# Altium schematic sheet [03] - FMCP_1&2.SchDoc
size A3; Author: Orcel Thys; DrawnBy: Orcel Thys; DocumentNumber: 10; SheetNumber: 10; SheetTotal: 14
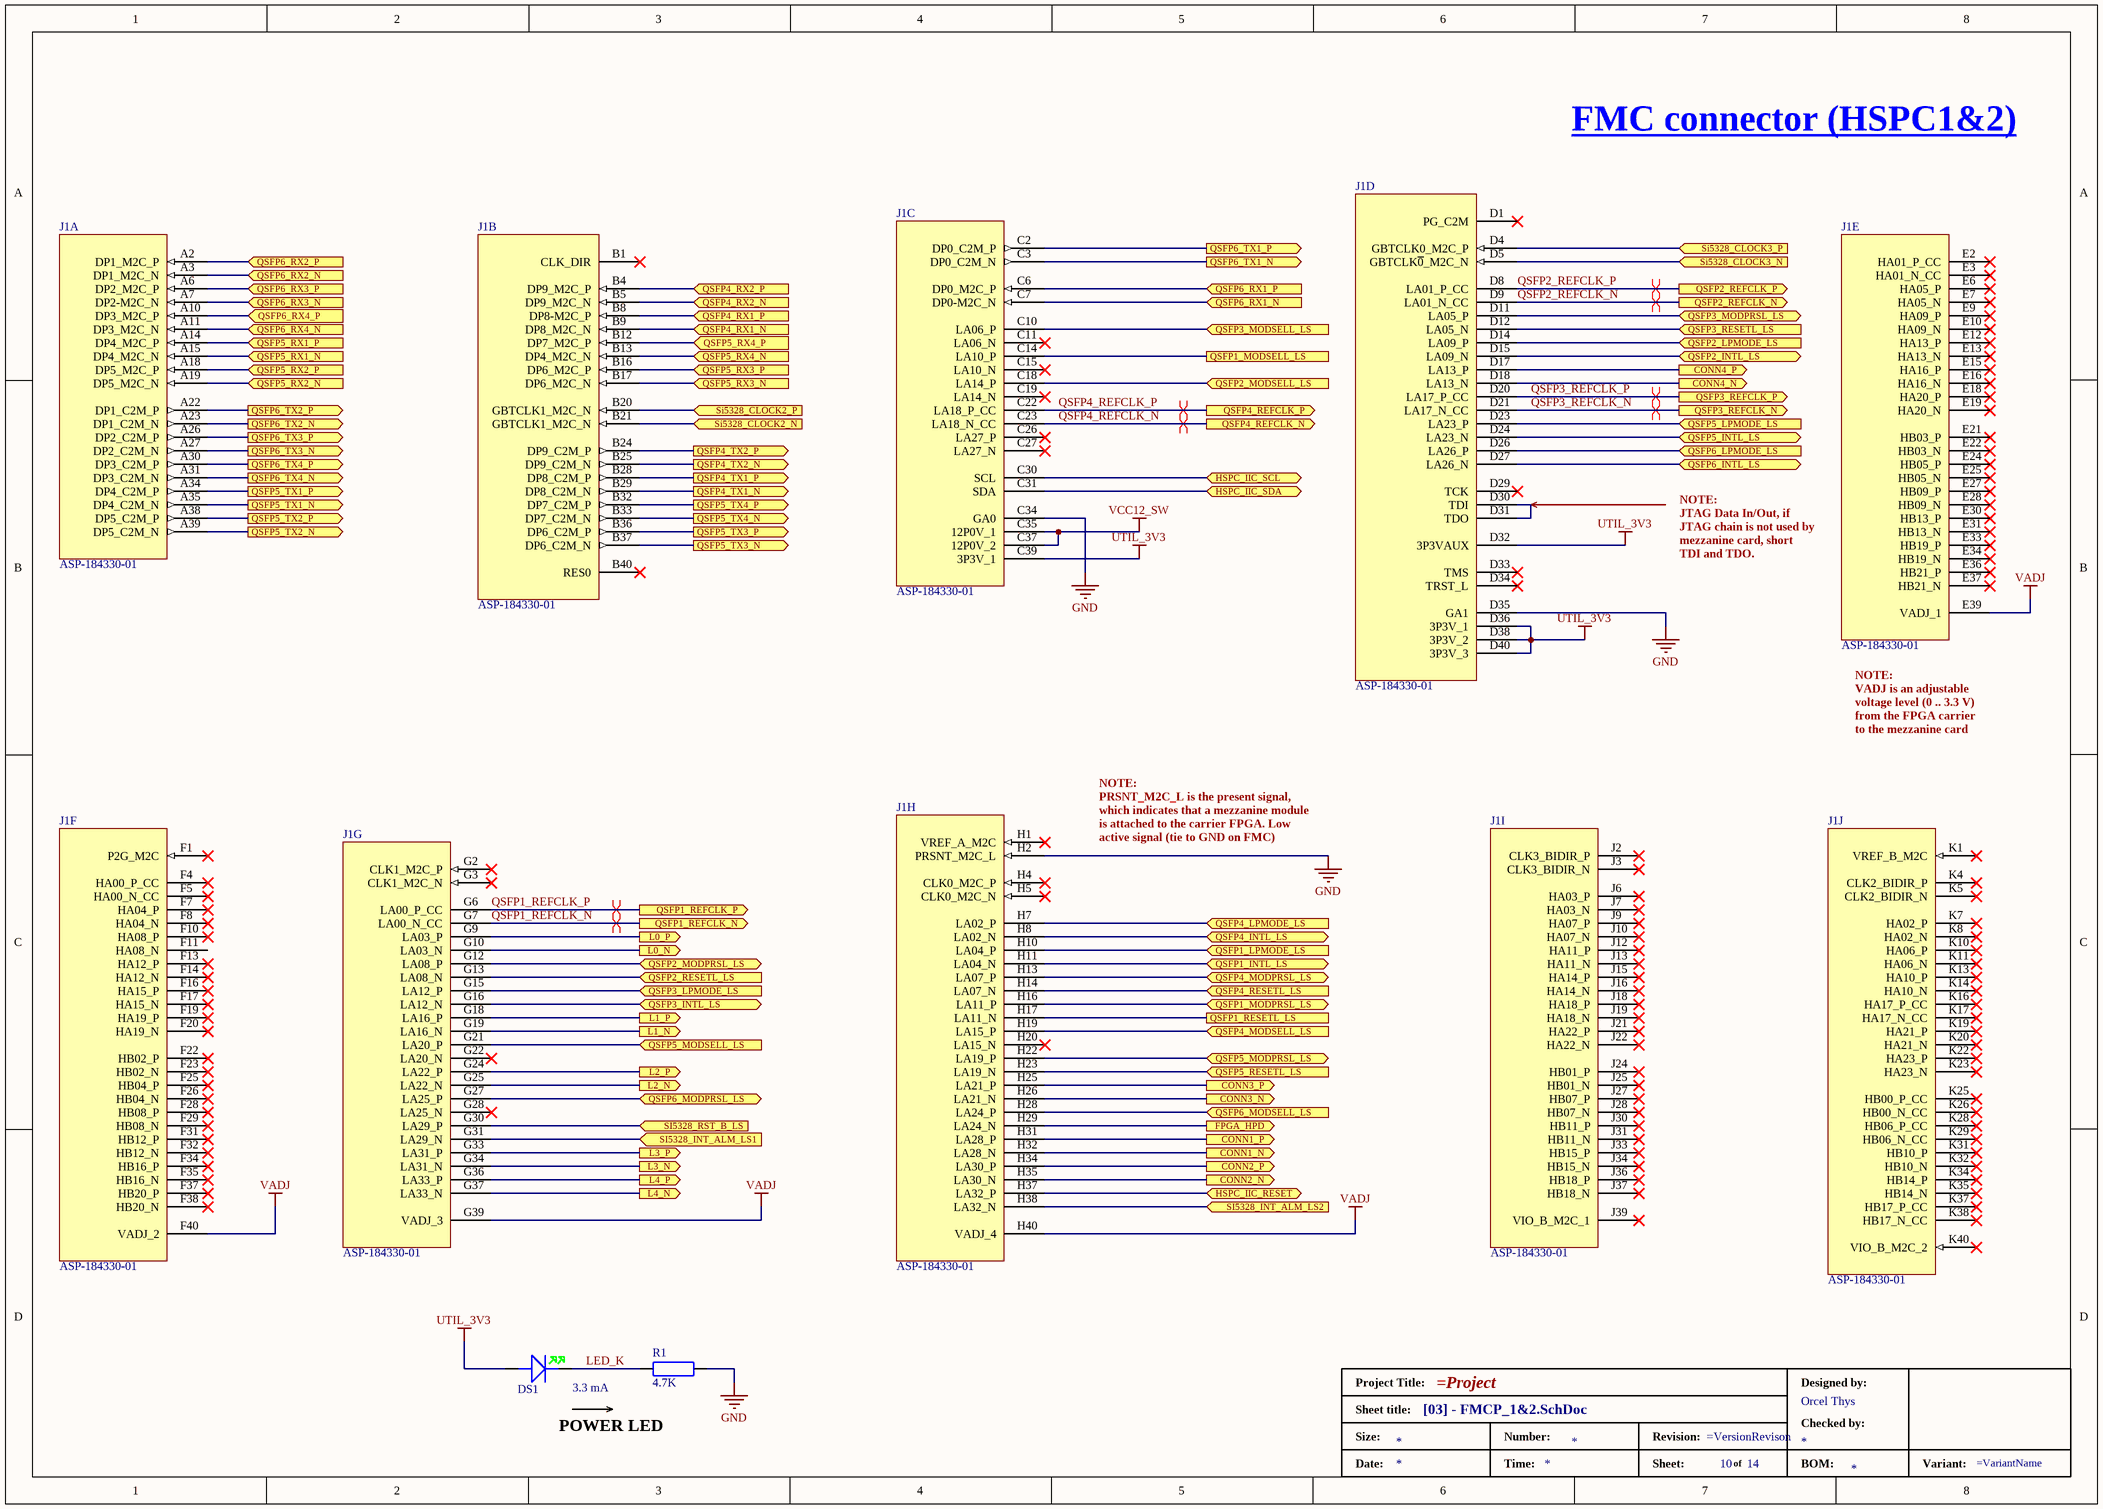
[diagram p0: [03] - FMCP_1&2.SchDoc]

## Parts
*  DesignedBy: Orcel Thys  (hidden comment: Standard Title Block)  (graphical)
DS1  GREEN LED  [LX0603GW-TR]  (value not drawn)
J1  FMCP HSPC  [SAMTEC_ASP-184330-01]  (value not drawn)  (parts A,B,C,D,E,F,G,H,I,J of 16)
R1  4.7K  [R0402]

## Ports
CONN1_N (out), CONN1_P (out), CONN2_N (out), CONN2_P (out), CONN3_N (out), CONN3_P (out), CONN4_N (out), CONN4_P (out), FPGA_HPD (out), HSPC_IIC_RESET (bidir), HSPC_IIC_SCL (bidir), HSPC_IIC_SDA (bidir), L0_N (out), L0_P (out), L1_N (out), L1_P (out), L2_N (out), L2_P (out), L3_N (out), L3_P (out), L4_N (out), L4_P (out), QSFP1_INTL_LS (bidir), QSFP1_LPMODE_LS (in), QSFP1_MODPRSL_LS (bidir), QSFP1_MODSELL_LS, QSFP1_REFCLK_N (out), QSFP1_REFCLK_P (out), QSFP1_RESETL_LS, QSFP2_INTL_LS (bidir), QSFP2_LPMODE_LS (in), QSFP2_MODPRSL_LS (bidir), QSFP2_MODSELL_LS (in), QSFP2_REFCLK_N (out), QSFP2_REFCLK_P (out), QSFP2_RESETL_LS (in), QSFP3_INTL_LS (bidir), QSFP3_LPMODE_LS (in), QSFP3_MODPRSL_LS (bidir), QSFP3_MODSELL_LS (in), QSFP3_REFCLK_N (out), QSFP3_REFCLK_P (out), QSFP3_RESETL_LS (in), QSFP4_INTL_LS (bidir), QSFP4_LPMODE_LS (in), QSFP4_MODPRSL_LS (bidir), QSFP4_MODSELL_LS (in), QSFP4_REFCLK_N (out), QSFP4_REFCLK_P (out), QSFP4_RESETL_LS (in), QSFP4_RX1_N (in), QSFP4_RX1_P (in), QSFP4_RX2_N (in), QSFP4_RX2_P (in), QSFP4_TX1_N (out), QSFP4_TX1_P (out), QSFP4_TX2_N (out), QSFP4_TX2_P (out), QSFP5_INTL_LS (bidir), QSFP5_LPMODE_LS (in), QSFP5_MODPRSL_LS (bidir), QSFP5_MODSELL_LS (in), QSFP5_RESETL_LS (in), QSFP5_RX1_N (in), QSFP5_RX1_P (in), QSFP5_RX2_N (in), QSFP5_RX2_P (in), QSFP5_RX3_N (in), QSFP5_RX3_P (in), QSFP5_RX4_N (in), QSFP5_RX4_P (in), QSFP5_TX1_N (out), QSFP5_TX1_P (out), QSFP5_TX2_N (out), QSFP5_TX2_P (out), QSFP5_TX3_N (out), QSFP5_TX3_P (out), QSFP5_TX4_N (out), QSFP5_TX4_P (out), QSFP6_INTL_LS (bidir), QSFP6_LPMODE_LS (in), QSFP6_MODPRSL_LS (bidir), QSFP6_MODSELL_LS (in), QSFP6_RX1_N (in), QSFP6_RX1_P (in), QSFP6_RX2_N (in), QSFP6_RX2_P (in), QSFP6_RX3_N (in), QSFP6_RX3_P (in), QSFP6_RX4_N (in), QSFP6_RX4_P (in), QSFP6_TX1_N (out), QSFP6_TX1_P (out), QSFP6_TX2_N (out), QSFP6_TX2_P (out), QSFP6_TX3_N (out), QSFP6_TX3_P (out), QSFP6_TX4_N (out), QSFP6_TX4_P (out), Si5328_CLOCK2_N (in), Si5328_CLOCK2_P (in), Si5328_CLOCK3_N (in), Si5328_CLOCK3_P (in), SI5328_INT_ALM_LS1 (in), SI5328_INT_ALM_LS2 (in), SI5328_RST_B_LS (in)

## Nets
GND: J1.C34(GA0) J1.D35(GA1) J1.H2(PRSNT_M2C_L) R1.1
UTIL_3V3: DS1.2(A) J1.C39(3P3V_1) J1.D32(3P3VAUX) J1.D36(3P3V_1) J1.D38(3P3V_2) J1.D40(3P3V_3)
VADJ: J1.E39(VADJ_1) J1.F40(VADJ_2) J1.G39(VADJ_3) J1.H40(VADJ_4)
VCC12_SW: J1.C35(12P0V_1) J1.C37(12P0V_2)
CONN1_N: J1.H32(LA28_N) ; port CONN1_N
CONN1_P: J1.H31(LA28_P) ; port CONN1_P
CONN2_N: J1.H35(LA30_N) ; port CONN2_N
CONN2_P: J1.H34(LA30_P) ; port CONN2_P
CONN3_N: J1.H26(LA21_N) ; port CONN3_N
CONN3_P: J1.H25(LA21_P) ; port CONN3_P
CONN4_N: J1.D18(LA13_N) ; port CONN4_N
CONN4_P: J1.D17(LA13_P) ; port CONN4_P
FPGA_HPD: J1.H29(LA24_N) ; port FPGA_HPD
HSPC_IIC_RESET: J1.H37(LA32_P) ; port HSPC_IIC_RESET
HSPC_IIC_SCL: J1.C30(SCL) ; port HSPC_IIC_SCL
HSPC_IIC_SDA: J1.C31(SDA) ; port HSPC_IIC_SDA
L0_N: J1.G10(LA03_N) ; port L0_N
L0_P: J1.G9(LA03_P) ; port L0_P
L1_N: J1.G19(LA16_N) ; port L1_N
L1_P: J1.G18(LA16_P) ; port L1_P
L2_N: J1.G25(LA22_N) ; port L2_N
L2_P: J1.G24(LA22_P) ; port L2_P
L3_N: J1.G34(LA31_N) ; port L3_N
L3_P: J1.G33(LA31_P) ; port L3_P
L4_N: J1.G37(LA33_N) ; port L4_N
L4_P: J1.G36(LA33_P) ; port L4_P
LED_K: DS1.1(K) R1.2
QSFP1_INTL_LS: J1.H11(LA04_N) ; port QSFP1_INTL_LS
QSFP1_LPMODE_LS: J1.H10(LA04_P) ; port QSFP1_LPMODE_LS
QSFP1_MODPRSL_LS: J1.H16(LA11_P) ; port QSFP1_MODPRSL_LS
QSFP1_MODSELL_LS: J1.C14(LA10_P) ; port QSFP1_MODSELL_LS
QSFP1_REFCLK_N: J1.G7(LA00_N_CC) ; port QSFP1_REFCLK_N
QSFP1_REFCLK_P: J1.G6(LA00_P_CC) ; port QSFP1_REFCLK_P
QSFP1_RESETL_LS: J1.H17(LA11_N) ; port QSFP1_RESETL_LS
QSFP2_INTL_LS: J1.D15(LA09_N) ; port QSFP2_INTL_LS
QSFP2_LPMODE_LS: J1.D14(LA09_P) ; port QSFP2_LPMODE_LS
QSFP2_MODPRSL_LS: J1.G12(LA08_P) ; port QSFP2_MODPRSL_LS
QSFP2_MODSELL_LS: J1.C18(LA14_P) ; port QSFP2_MODSELL_LS
QSFP2_REFCLK_N: J1.D9(LA01_N_CC) ; port QSFP2_REFCLK_N
QSFP2_REFCLK_P: J1.D8(LA01_P_CC) ; port QSFP2_REFCLK_P
QSFP2_RESETL_LS: J1.G13(LA08_N) ; port QSFP2_RESETL_LS
QSFP3_INTL_LS: J1.G16(LA12_N) ; port QSFP3_INTL_LS
QSFP3_LPMODE_LS: J1.G15(LA12_P) ; port QSFP3_LPMODE_LS
QSFP3_MODPRSL_LS: J1.D11(LA05_P) ; port QSFP3_MODPRSL_LS
QSFP3_MODSELL_LS: J1.C10(LA06_P) ; port QSFP3_MODSELL_LS
QSFP3_REFCLK_N: J1.D21(LA17_N_CC) ; port QSFP3_REFCLK_N
QSFP3_REFCLK_P: J1.D20(LA17_P_CC) ; port QSFP3_REFCLK_P
QSFP3_RESETL_LS: J1.D12(LA05_N) ; port QSFP3_RESETL_LS
QSFP4_INTL_LS: J1.H8(LA02_N) ; port QSFP4_INTL_LS
QSFP4_LPMODE_LS: J1.H7(LA02_P) ; port QSFP4_LPMODE_LS
QSFP4_MODPRSL_LS: J1.H13(LA07_P) ; port QSFP4_MODPRSL_LS
QSFP4_MODSELL_LS: J1.H19(LA15_P) ; port QSFP4_MODSELL_LS
QSFP4_REFCLK_N: J1.C23(LA18_N_CC) ; port QSFP4_REFCLK_N
QSFP4_REFCLK_P: J1.C22(LA18_P_CC) ; port QSFP4_REFCLK_P
QSFP4_RESETL_LS: J1.H14(LA07_N) ; port QSFP4_RESETL_LS
QSFP4_RX1_N: J1.B9(DP8_M2C_N) ; port QSFP4_RX1_N
QSFP4_RX1_P: J1.B8(DP8-M2C_P) ; port QSFP4_RX1_P
QSFP4_RX2_N: J1.B5(DP9_M2C_N) ; port QSFP4_RX2_N
QSFP4_RX2_P: J1.B4(DP9_M2C_P) ; port QSFP4_RX2_P
QSFP4_TX1_N: J1.B29(DP8_C2M_N) ; port QSFP4_TX1_N
QSFP4_TX1_P: J1.B28(DP8_C2M_P) ; port QSFP4_TX1_P
QSFP4_TX2_N: J1.B25(DP9_C2M_N) ; port QSFP4_TX2_N
QSFP4_TX2_P: J1.B24(DP9_C2M_P) ; port QSFP4_TX2_P
QSFP5_INTL_LS: J1.D24(LA23_N) ; port QSFP5_INTL_LS
QSFP5_LPMODE_LS: J1.D23(LA23_P) ; port QSFP5_LPMODE_LS
QSFP5_MODPRSL_LS: J1.H22(LA19_P) ; port QSFP5_MODPRSL_LS
QSFP5_MODSELL_LS: J1.G21(LA20_P) ; port QSFP5_MODSELL_LS
QSFP5_RESETL_LS: J1.H23(LA19_N) ; port QSFP5_RESETL_LS
QSFP5_RX1_N: J1.A15(DP4_M2C_N) ; port QSFP5_RX1_N
QSFP5_RX1_P: J1.A14(DP4_M2C_P) ; port QSFP5_RX1_P
QSFP5_RX2_N: J1.A19(DP5_M2C_N) ; port QSFP5_RX2_N
QSFP5_RX2_P: J1.A18(DP5_M2C_P) ; port QSFP5_RX2_P
QSFP5_RX3_N: J1.B17(DP6_M2C_N) ; port QSFP5_RX3_N
QSFP5_RX3_P: J1.B16(DP6_M2C_P) ; port QSFP5_RX3_P
QSFP5_RX4_N: J1.B13(DP4_M2C_N) ; port QSFP5_RX4_N
QSFP5_RX4_P: J1.B12(DP7_M2C_P) ; port QSFP5_RX4_P
QSFP5_TX1_N: J1.A35(DP4_C2M_N) ; port QSFP5_TX1_N
QSFP5_TX1_P: J1.A34(DP4_C2M_P) ; port QSFP5_TX1_P
QSFP5_TX2_N: J1.A39(DP5_C2M_N) ; port QSFP5_TX2_N
QSFP5_TX2_P: J1.A38(DP5_C2M_P) ; port QSFP5_TX2_P
QSFP5_TX3_N: J1.B37(DP6_C2M_N) ; port QSFP5_TX3_N
QSFP5_TX3_P: J1.B36(DP6_C2M_P) ; port QSFP5_TX3_P
QSFP5_TX4_N: J1.B33(DP7_C2M_N) ; port QSFP5_TX4_N
QSFP5_TX4_P: J1.B32(DP7_C2M_P) ; port QSFP5_TX4_P
QSFP6_INTL_LS: J1.D27(LA26_N) ; port QSFP6_INTL_LS
QSFP6_LPMODE_LS: J1.D26(LA26_P) ; port QSFP6_LPMODE_LS
QSFP6_MODPRSL_LS: J1.G27(LA25_P) ; port QSFP6_MODPRSL_LS
QSFP6_MODSELL_LS: J1.H28(LA24_P) ; port QSFP6_MODSELL_LS
QSFP6_RX1_N: J1.C7(DP0-M2C_N) ; port QSFP6_RX1_N
QSFP6_RX1_P: J1.C6(DP0_M2C_P) ; port QSFP6_RX1_P
QSFP6_RX2_N: J1.A3(DP1_M2C_N) ; port QSFP6_RX2_N
QSFP6_RX2_P: J1.A2(DP1_M2C_P) ; port QSFP6_RX2_P
QSFP6_RX3_N: J1.A7(DP2-M2C_N) ; port QSFP6_RX3_N
QSFP6_RX3_P: J1.A6(DP2_M2C_P) ; port QSFP6_RX3_P
QSFP6_RX4_N: J1.A11(DP3_M2C_N) ; port QSFP6_RX4_N
QSFP6_RX4_P: J1.A10(DP3_M2C_P) ; port QSFP6_RX4_P
QSFP6_TX1_N: J1.C3(DP0_C2M_N) ; port QSFP6_TX1_N
QSFP6_TX1_P: J1.C2(DP0_C2M_P) ; port QSFP6_TX1_P
QSFP6_TX2_N: J1.A23(DP1_C2M_N) ; port QSFP6_TX2_N
QSFP6_TX2_P: J1.A22(DP1_C2M_P) ; port QSFP6_TX2_P
QSFP6_TX3_N: J1.A27(DP2_C2M_N) ; port QSFP6_TX3_N
QSFP6_TX3_P: J1.A26(DP2_C2M_P) ; port QSFP6_TX3_P
QSFP6_TX4_N: J1.A31(DP3_C2M_N) ; port QSFP6_TX4_N
QSFP6_TX4_P: J1.A30(DP3_C2M_P) ; port QSFP6_TX4_P
Si5328_CLOCK2_N: J1.B21(GBTCLK1_M2C_N) ; port Si5328_CLOCK2_N
Si5328_CLOCK2_P: J1.B20(GBTCLK1_M2C_N) ; port Si5328_CLOCK2_P
Si5328_CLOCK3_N: J1.D5(GBTCLK~{0}_M2C_N) ; port Si5328_CLOCK3_N
Si5328_CLOCK3_P: J1.D4(GBTCLK0_M2C_P) ; port Si5328_CLOCK3_P
SI5328_INT_ALM_LS1: J1.G31(LA29_N) ; port SI5328_INT_ALM_LS1
SI5328_INT_ALM_LS2: J1.H38(LA32_N) ; port SI5328_INT_ALM_LS2
SI5328_RST_B_LS: J1.G30(LA29_P) ; port SI5328_RST_B_LS
NetJ1_D30: J1.D30(TDI) J1.D31(TDO)

Not connected (* = marked no-connect by the designer): J1 B1(CLK_DIR)* B40(RES0)* C11(LA06_N)* C15(LA10_N)* C19(LA14_N)* C26(LA27_P)* C27(LA27_N)* D1(PG_C2M)* D29(TCK)* D33(TMS)* D34(TRST_L)* E2(HA01_P_CC)* E3(HA01_N_CC)* E6(HA05_P)* E7(HA05_N)* E9(HA09_P)* E10(HA09_N)* E12(HA13_P)* E13(HA13_N)* E15(HA16_P)* E16(HA16_N)* E18(HA20_P)* E19(HA20_N)* E21(HB03_P)* E22(HB03_N)* E24(HB05_P)* E25(HB05_N)* E27(HB09_P)* E28(HB09_N)* E30(HB13_P)* E31(HB13_N)* E33(HB19_P)* E34(HB19_N)* E36(HB21_P)* E37(HB21_N)* F1(P2G_M2C)* F4(HA00_P_CC)* F5(HA00_N_CC)* F7(HA04_P)* F8(HA04_N)* F10(HA08_P)* F11(HA08_N) F13(HA12_P)* F14(HA12_N)* F16(HA15_P)* F17(HA15_N)* F19(HA19_P)* F20(HA19_N)* F22(HB02_P)* F23(HB02_N)* F25(HB04_P)* F26(HB04_N)* F28(HB08_P)* F29(HB08_N)* F31(HB12_P)* F32(HB12_N)* F34(HB16_P)* F35(HB16_N)* F37(HB20_P)* F38(HB20_N)* G2(CLK1_M2C_P)* G3(CLK1_M2C_N)* G22(LA20_N)* G28(LA25_N)* H1(VREF_A_M2C)* H4(CLK0_M2C_P)* H5(CLK0_M2C_N)* H20(LA15_N)* J2(CLK3_BIDIR_P)* J3(CLK3_BIDIR_N)* J6(HA03_P)* J7(HA03_N)* J9(HA07_P)* J10(HA07_N)* J12(HA11_P)* J13(HA11_N)* J15(HA14_P)* J16(HA14_N)* J18(HA18_P)* J19(HA18_N)* J21(HA22_P)* J22(HA22_N)* J24(HB01_P)* J25(HB01_N)* J27(HB07_P)* J28(HB07_N)* J30(HB11_P)* J31(HB11_N)* J33(HB15_P)* J34(HB15_N)* J36(HB18_P)* J37(HB18_N)* J39(VIO_B_M2C_1)* K1(VREF_B_M2C)* K4(CLK2_BIDIR_P)* K5(CLK2_BIDIR_N)* K7(HA02_P)* K8(HA02_N)* K10(HA06_P)* K11(HA06_N)* K13(HA10_P)* K14(HA10_N)* K16(HA17_P_CC)* K17(HA17_N_CC)* K19(HA21_P)* K20(HA21_N)* K22(HA23_P)* K23(HA23_N)* K25(HB00_P_CC)* K26(HB00_N_CC)* K28(HB06_P_CC)* K29(HB06_N_CC)* K31(HB10_P)* K32(HB10_N)* K34(HB14_P)* K35(HB14_N)* K37(HB17_P_CC)* K38(HB17_N_CC)* K40(VIO_B_M2C_2)*

## Layout directives
differential pair: QSFP1_REFCLK_N, QSFP1_REFCLK_P, QSFP2_REFCLK_N, QSFP2_REFCLK_P, QSFP3_REFCLK_N, QSFP3_REFCLK_P, QSFP4_REFCLK_N, QSFP4_REFCLK_P

## Notes on the sheet
- FMC connector (HSPC1&2)
- NOTE:
  JTAG Data In/Out, if JTAG chain is not used by mezzanine card, short TDI and TDO.
- NOTE:
  VADJ is an adjustable voltage level (0 .. 3.3 V) from the FPGA carrier to the mezzanine card (max. 6 A).
- NOTE:
  PRSNT_M2C_L is the present signal, which indicates that a mezzanine module is attached to the carrier FPGA. Low active signal (tie to GND on FMC)
- (near DS1) 3.3 mA
- POWER LED
- Title
- Size:
- Date:
- A4
- Number:
- Time:
- Revision:
- Sheet
- of
- File:
- (in symbol Title_Block) Project Title:; Designed by:; Sheet title:; Checked by:; Size:; Number:; Revision:; Date:; Time:; Sheet:; of; BOM:; Variant:

## Library data of the parts
* = Title_Block: Size: *; BOM: *; DW: *; CheckedBy: *
DS1 = SML-LX0603GW-TR: Green 0603 1.6 x 0.8 mm 160° Diffused 18 mcd 2.2 V PCB Chip Surface Mount LED; Manufacturer: Lumex; Lens Color: White; Lens Style: Flat,Rectangular; Luminous Intensity: 18mcd; Forward Voltage: 2.2V; Test Current: 20mA; Lens Size: 0.8mm; Supplier 1: Farnell; Manufacturer Part Number: SML-LX0603GW-TR; RoHS: Yes; Category: LEDs; Stock 1: 39795; Pricing 1: 5=0.319, 10=0.238, 100=0.116, 500=0.101, 1000=0.0847 (EUR); Mount: Surface Mount; Case/Package: 0603; Color: Green; Case Code (Imperial): 0603; Case Code (Metric): 1608; Weight: 30mg; Min Operating Temperature: -25°C; Max Operating Temperature: 85°C; Illumination Color: Green; Packaging: Cut Tape; Viewing Angle: 160°; Forward Current: 20mA; Package Quantity: 4000; Series: -; Lens Transparency: Diffused; Length: 1.6mm; Width: 0.8mm; Height: 0.6mm; RoHS Compliant: Yes; ComponentLink1URL: http://www.farnell.com/datasheets/147993.pdf?src-supplier=Farnell; ComponentLink1Description: http://www.farnell.com/datasheets/147993.pdf?src-supplier=Farnell; ComponentLink2URL: http://www.farnell.com/datasheets/147993.pdf?src-supplier=Newark; ComponentLink2Description: http://www.farnell.com/datasheets/147993.pdf?src-supplier=Newark; ComponentLink3URL: http://www.farnell.com/datasheets/147993.pdf?src-supplier=Element14; ComponentLink3Description: http://www.farnell.com/datasheets/147993.pdf?src-supplier=Element14; ComponentLink4URL: https://www.lumex.com/content/files/ProductAttachment/SML-LX0603GW-TR.pdf?src-supplier=Digi-Key; ComponentLink4Description: https://www.lumex.com/content/files/ProductAttachment/SML-LX0603GW-TR.pdf?src-supplier=Digi-Key; Supplier Part Number 1: 1611307
J1 = ASP-184330-01: Male Conn Open Pin Field Array PIN 560 POS 1.27mm Solder ST Top Entry SMD; Manufacturer: Samtec; Mated Stacking Heights: 11.5mm; Supplier 1: Arrow Electronics; Manufacturer Part Number: ASP-184330-01; RoHS: Yes; Category: Board to Board Connectors; Stock 1: 75; Pricing 1: 1=47.84, 10=45.01, 25=42.16 (USD); Mount: Surface Mount; Contact Plating: Gold; Packaging: Strip; Number of Rows: 14; ComponentLink1URL: http://suddendocs.samtec.com/prints/asp-184330-01-mkt.pdf?src-supplier=Digi-Key; ComponentLink1Description: http://suddendocs.samtec.com/prints/asp-184330-01-mkt.pdf?src-supplier=Digi-Key; ComponentLink2URL: http://datasheet.octopart.com/ASP-184330-01-Samtec-datasheet-137321575.pdf?src-supplier=Rs; ComponentLink2Description: http://datasheet.octopart.com/ASP-184330-01-Samtec-datasheet-137321575.pdf?src-supplier=Rs; Supplier Part Number 1: ASP-184330-01
R1 = ERJ-2RKF4701X: RES Thick Film 0402 4.7K Ohm 1% 1/10W ±100ppm/°C Molded SMD Punched Carrier T/R; Manufacturer: Panasonic; Resistance: 4.7kR; Power Rating: 100mW; Voltage Rating: 50V; Supplier 1: Mouser; Manufacturer Part Number: ERJ-2RKF4701X; RoHS: Yes; Category: Chip SMD Resistors; Stock 1: 4815685; Pricing 1: 1=0.1, 10=0.018, 50=0.018, 100=0.008, 1000=0.006, 10000=0.003 (USD); Case Code (Metric): 1005; Case Code (Imperial): 0402; Weight: 0.000388oz; Min Operating Temperature: -55°C; Max Operating Temperature: 155°C; Tolerance: 1%; Temperature Coefficient: 100ppm/°C; Packaging: Cut Tape; Package Quantity: 10000; Termination: SMD/SMT; Voltage Rating (DC): 50V; Series: ERJ-2Rx; Technology: THICK FILM; Length: 1mm; Width: 0.5mm; Height: 0.35mm; Lead Free: Lead Free; RoHS Compliant: Yes; ComponentLink1URL: https://datasheet.ciiva.com/11821/0900766b80f80784-11821329.pdf?src-supplier=Rs; ComponentLink1Description: https://datasheet.ciiva.com/11821/0900766b80f80784-11821329.pdf?src-supplier=Rs; ComponentLink2URL: https://datasheet.ciiva.com/7830/aoa0000ce2-7830727.pdf?src-supplier=Element14; ComponentLink2Description: https://datasheet.ciiva.com/7830/aoa0000ce2-7830727.pdf?src-supplier=Element14; ComponentLink3URL: https://datasheet.ciiva.com/22781/1678782-22781576.pdf?src-supplier=Farnell; ComponentLink3Description: https://datasheet.ciiva.com/22781/1678782-22781576.pdf?src-supplier=Farnell; ComponentLink4URL: https://datasheet.ciiva.com/22667/1678782-22667886.pdf?src-supplier=Element14; ComponentLink4Description: https://datasheet.ciiva.com/22667/1678782-22667886.pdf?src-supplier=Element14; ComponentLink5URL: https://datasheet.ciiva.com/22723/1678782-22723903.pdf?src-supplier=Element14; ComponentLink5Description: https://datasheet.ciiva.com/22723/1678782-22723903.pdf?src-supplier=Element14; ComponentLink6URL: https://datasheet.ciiva.com/24025/aoa0000ce2-24025663.pdf?src-supplier=Mouser; ComponentLink6Description: https://datasheet.ciiva.com/24025/aoa0000ce2-24025663.pdf?src-supplier=Mouser; ComponentLink7URL: https://datasheet.ciiva.com/16763/70260748-16763151.pdf?src-supplier=Allied+Electronics; ComponentLink7Description: https://datasheet.ciiva.com/16763/70260748-16763151.pdf?src-supplier=Allied+Electronics; ComponentLink8URL: https://datasheet.ciiva.com/9195/aoa0000ce2-9195737.pdf?src-supplier=Avnet; ComponentLink8Description: https://datasheet.ciiva.com/9195/aoa0000ce2-9195737.pdf?src-supplier=Avnet; ComponentLink9URL: https://datasheet.ciiva.com/30053/aoa0000ce2-30053990.pdf?src-supplier=Onlinecomponents.com; ComponentLink9Description: https://datasheet.ciiva.com/30053/aoa0000ce2-30053990.pdf?src-supplier=Onlinecomponents.com; Supplier Part Number 1: 667-ERJ-2RKF4701X